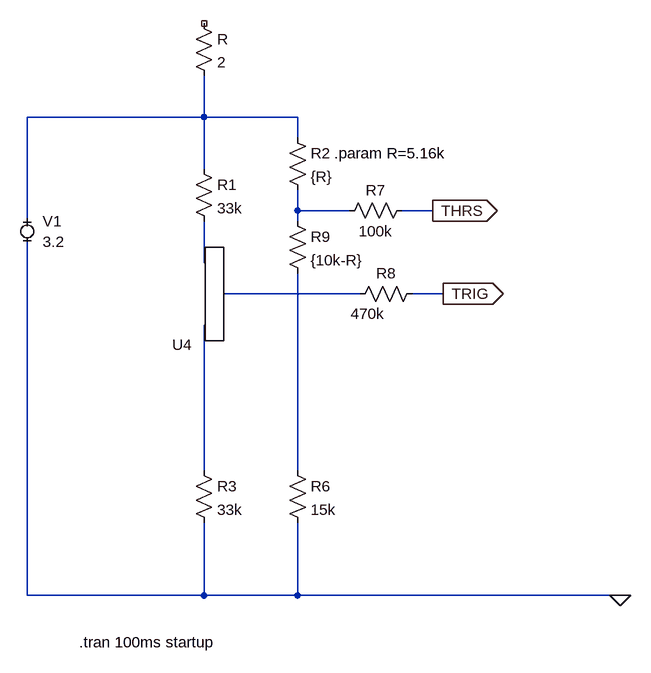
[diagram p0: schematic diff.asc]
diff.asc, the LTspice schematic file:
Version 4
SHEET 1 1952 1524
WIRE -400 80 -400 16
WIRE -400 80 -672 80
WIRE -256 80 -400 80
WIRE -256 112 -256 80
WIRE -400 160 -400 80
WIRE -256 224 -256 192
WIRE -176 224 -256 224
WIRE -48 224 -96 224
WIRE -672 240 -672 80
WIRE -256 240 -256 224
WIRE -400 304 -400 240
WIRE -160 352 -368 352
WIRE -32 352 -80 352
WIRE -400 624 -400 400
WIRE -256 624 -256 320
WIRE -672 816 -672 272
WIRE -400 816 -400 704
WIRE -400 816 -672 816
WIRE -256 816 -256 704
WIRE -256 816 -400 816
WIRE 240 816 -256 816
WIRE 256 816 240 816
FLAG -48 224 THRS
IOPIN -48 224 Out
FLAG -32 352 TRIG
IOPIN -32 352 Out
FLAG 240 816 0
SYMBOL res -416 608 R0
SYMATTR InstName R3
SYMATTR Value 33k
SYMBOL res -416 144 R0
SYMATTR InstName R1
SYMATTR Value 33k
SYMBOL res -416 -80 R0
SYMATTR InstName R
SYMATTR Value 2
SYMATTR SpiceLine pwr=1
SYMBOL res -272 608 R0
SYMATTR InstName R6
SYMATTR Value 15k
SYMBOL res -80 208 R90
WINDOW 0 0 56 VBottom 2
WINDOW 3 32 56 VTop 2
SYMATTR InstName R7
SYMATTR Value 100k
SYMBOL res -64 336 R90
WINDOW 0 0 56 VBottom 2
WINDOW 3 31 84 VTop 2
SYMATTR InstName R8
SYMATTR Value 470k
SYMBOL EXTRA\\Misc\\pot -400 352 R180
SYMATTR InstName U4
SYMATTR Value2 T=.34325
SYMBOL res -272 96 R0
SYMATTR InstName R2
SYMATTR Value {R}
SYMBOL res -272 224 R0
SYMATTR InstName R9
SYMATTR Value {10k-R}
SYMBOL MiniSyms4\\voltage- -672 256 R0
WINDOW 123 0 0 Left 2
WINDOW 39 0 0 Left 2
SYMATTR InstName V1
SYMATTR Value 3.2
TEXT -592 888 Left 2 !.tran 100ms startup
TEXT -200 136 Left 2 !.param R=5.16k

The netlist it stands for:
* diff.asc
R3 N005 0 33k
R1 N001 N003 33k
R NC_01 N001 2 pwr=1
R6 N006 0 15k
R7 THRS N002 100k
R8 TRIG N004 470k
XU4 N005 N003 N004 T=.34325
R2 N001 N002 {R}
R9 N002 N006 {10k-R}
V1 N001 0 3.2
.tran 100ms startup
.param R=5.16k
.lib POT.lib
.backanno
.end